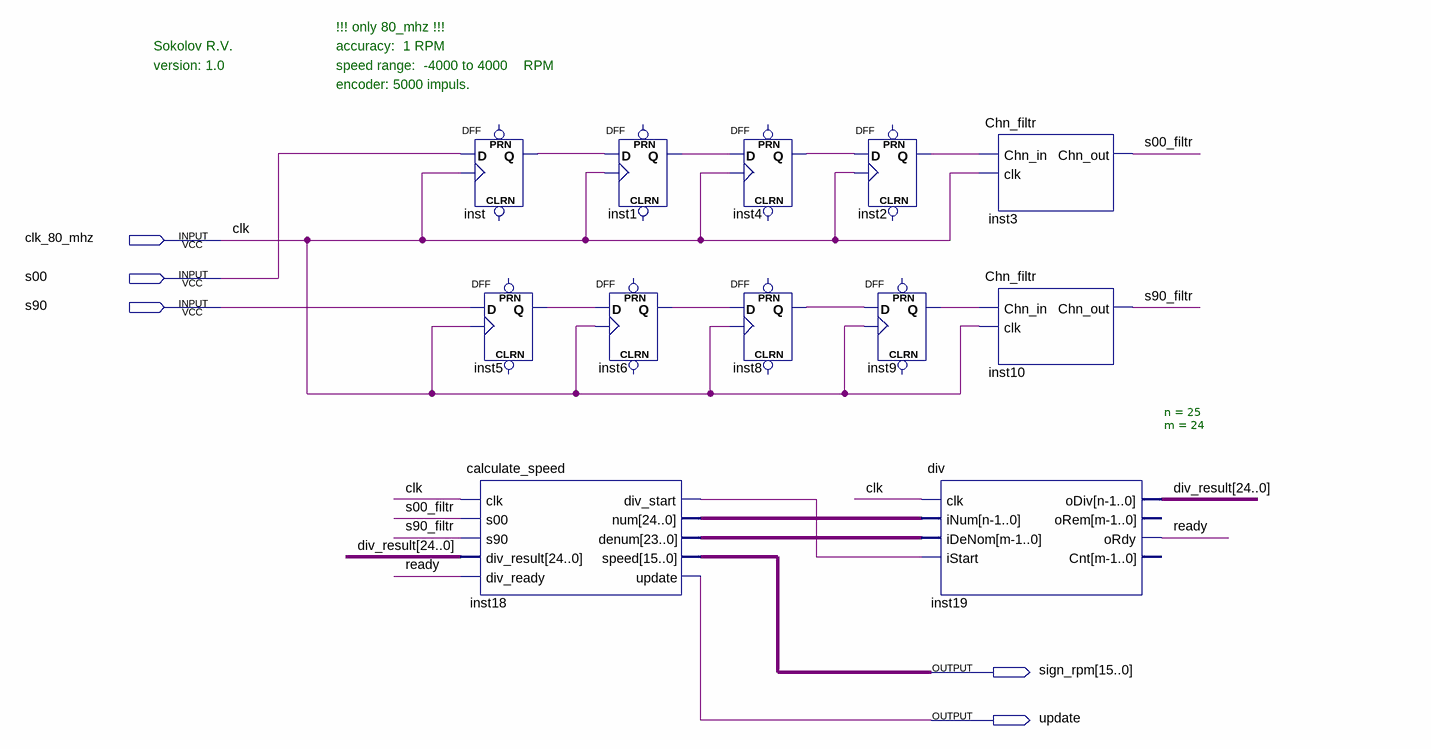
[diagram p0: schematic sheet]
// Quartus schematic encoder_1_0.bdf as structural Verilog: 12 symbols, 5 pins
module encoder_1_0 (
  input  clk_80_mhz,
  input  s00,
  input  s90,
  output [15:0] sign_rpm,
  output update
);

  wire inst1_q, inst2_q, inst4_q, inst5_q, inst6_q, inst8_q, inst9_q, inst18_div_start, inst_q, ready,
       s00_filtr, s90_filtr;
  wire [23:0] inst18_denum;
  wire [24:0] div_result, inst18_num;

  DFF inst (.CLK(clk_80_mhz), .D(s00), .Q(inst_q));  // open: CLRN, PRN
  DFF inst5 (.CLK(clk_80_mhz), .D(s90), .Q(inst5_q));  // open: CLRN, PRN
  calculate_speed inst18 (
    .clk(clk_80_mhz), .s00(s00_filtr), .s90(s90_filtr), .div_result(div_result), .div_ready(ready),
    .div_start(inst18_div_start), .num(inst18_num), .denum(inst18_denum), .speed(sign_rpm), .update(update));
  DFF inst1 (.CLK(clk_80_mhz), .D(inst_q), .Q(inst1_q));  // open: CLRN, PRN
  DFF inst6 (.CLK(clk_80_mhz), .D(inst5_q), .Q(inst6_q));  // open: CLRN, PRN
  DFF inst4 (.CLK(clk_80_mhz), .D(inst1_q), .Q(inst4_q));  // open: CLRN, PRN
  DFF inst8 (.CLK(clk_80_mhz), .D(inst6_q), .Q(inst8_q));  // open: CLRN, PRN
  DFF inst2 (.CLK(clk_80_mhz), .D(inst4_q), .Q(inst2_q));  // open: CLRN, PRN
  DFF inst9 (.CLK(clk_80_mhz), .D(inst8_q), .Q(inst9_q));  // open: CLRN, PRN
  div #(.n(25), .m(24)) inst19 (
    .clk(clk_80_mhz), .iNum(inst18_num), .iDeNom(inst18_denum), .iStart(inst18_div_start), .oDiv(div_result),
    .oRdy(ready));  // open: oRem, Cnt
  Chn_filtr inst3 (.Chn_in(inst2_q), .clk(clk_80_mhz), .Chn_out(s00_filtr));
  Chn_filtr inst10 (.Chn_in(inst9_q), .clk(clk_80_mhz), .Chn_out(s90_filtr));

  // Other names for the same wires on the sheet: clk = clk_80_mhz

  // Notes on the sheet:
  //   !!! only 80_mhz !!!
  //   Sokolov R.V.
  //   accuracy:  1 RPM
  //   version: 1.0
  //   speed range:  -4000 to 4000    RPM
  //   encoder: 5000 impuls.
endmodule
